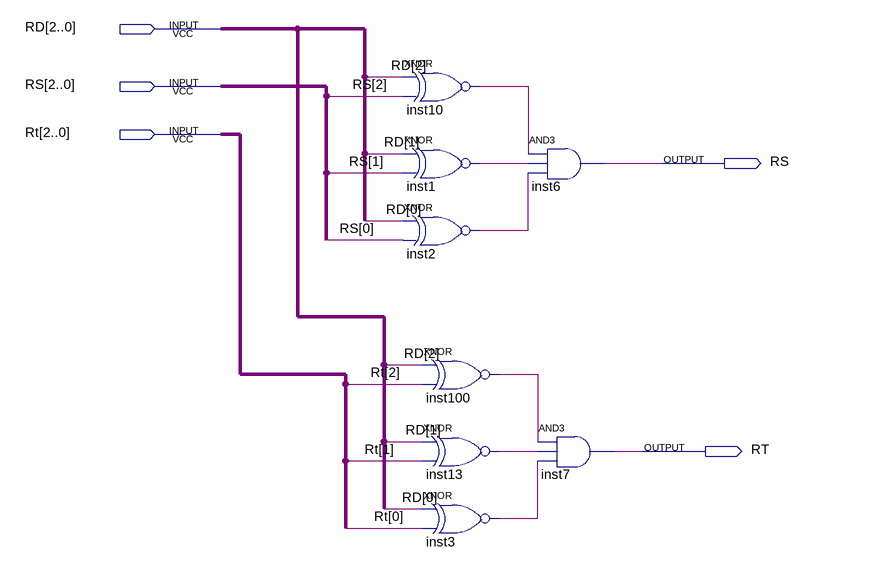
[diagram p0: schematic sheet]
// Quartus schematic controllerforwarding.bdf as structural Verilog: 8 symbols, 5 pins
module controllerforwarding (
  input  [2:0] RD,
  input  [2:0] RS,
  input  [2:0] Rt,
  output RS_1bit,
  output Rt_1bit
);

  wire inst1_out, inst2_out, inst3_out, inst10_out, inst13_out, inst100_out;

  xnor inst10 (inst10_out, RD[2], RS[2]);
  xnor inst1 (inst1_out, RD[1], RS[1]);
  xnor inst2 (inst2_out, RD[0], RS[0]);
  xnor inst100 (inst100_out, RD[2], Rt[2]);
  xnor inst13 (inst13_out, RD[1], Rt[1]);
  xnor inst3 (inst3_out, RD[0], Rt[0]);
  and inst6 (RS_1bit, inst10_out, inst1_out, inst2_out);
  and inst7 (Rt_1bit, inst100_out, inst13_out, inst3_out);
endmodule
